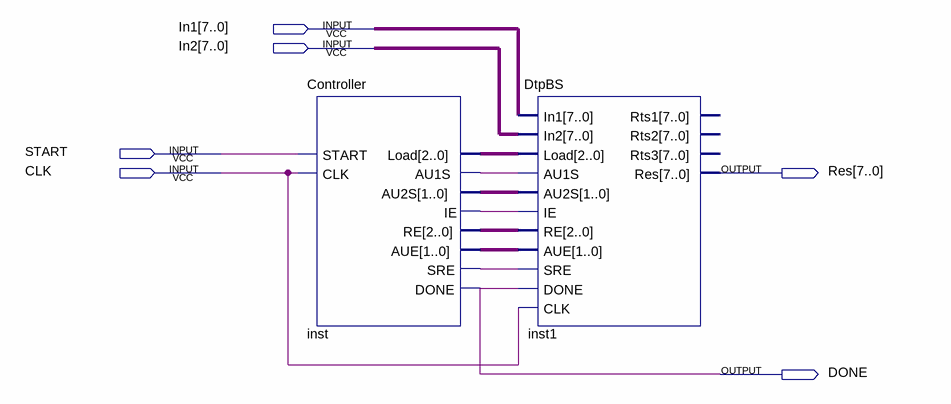
[diagram p0: schematic sheet]
// Quartus schematic BSCU.bdf as structural Verilog: 2 symbols, 6 pins
module BSCU (
  input  [7:0] In1,
  input  [7:0] In2,
  input  START,
  input  CLK,
  output [7:0] Res,
  output DONE
);

  wire inst_au1s, inst_ie, inst_sre;
  wire [1:0] inst_au2s, inst_aue;
  wire [2:0] inst_load, inst_re;

  Controller inst (
    .START(START), .CLK(CLK), .Load(inst_load), .AU1S(inst_au1s), .AU2S(inst_au2s), .IE(inst_ie),
    .RE(inst_re), .AUE(inst_aue), .SRE(inst_sre), .DONE(DONE));
  DtpBS inst1 (
    .In1(In1), .In2(In2), .Load(inst_load), .AU1S(inst_au1s), .AU2S(inst_au2s), .IE(inst_ie), .RE(inst_re),
    .AUE(inst_aue), .SRE(inst_sre), .DONE(DONE), .CLK(CLK), .Res(Res));  // open: Rts1, Rts2, Rts3
endmodule
